# EAGLE design quahog-2-routed (EAGLE 7.6.0)
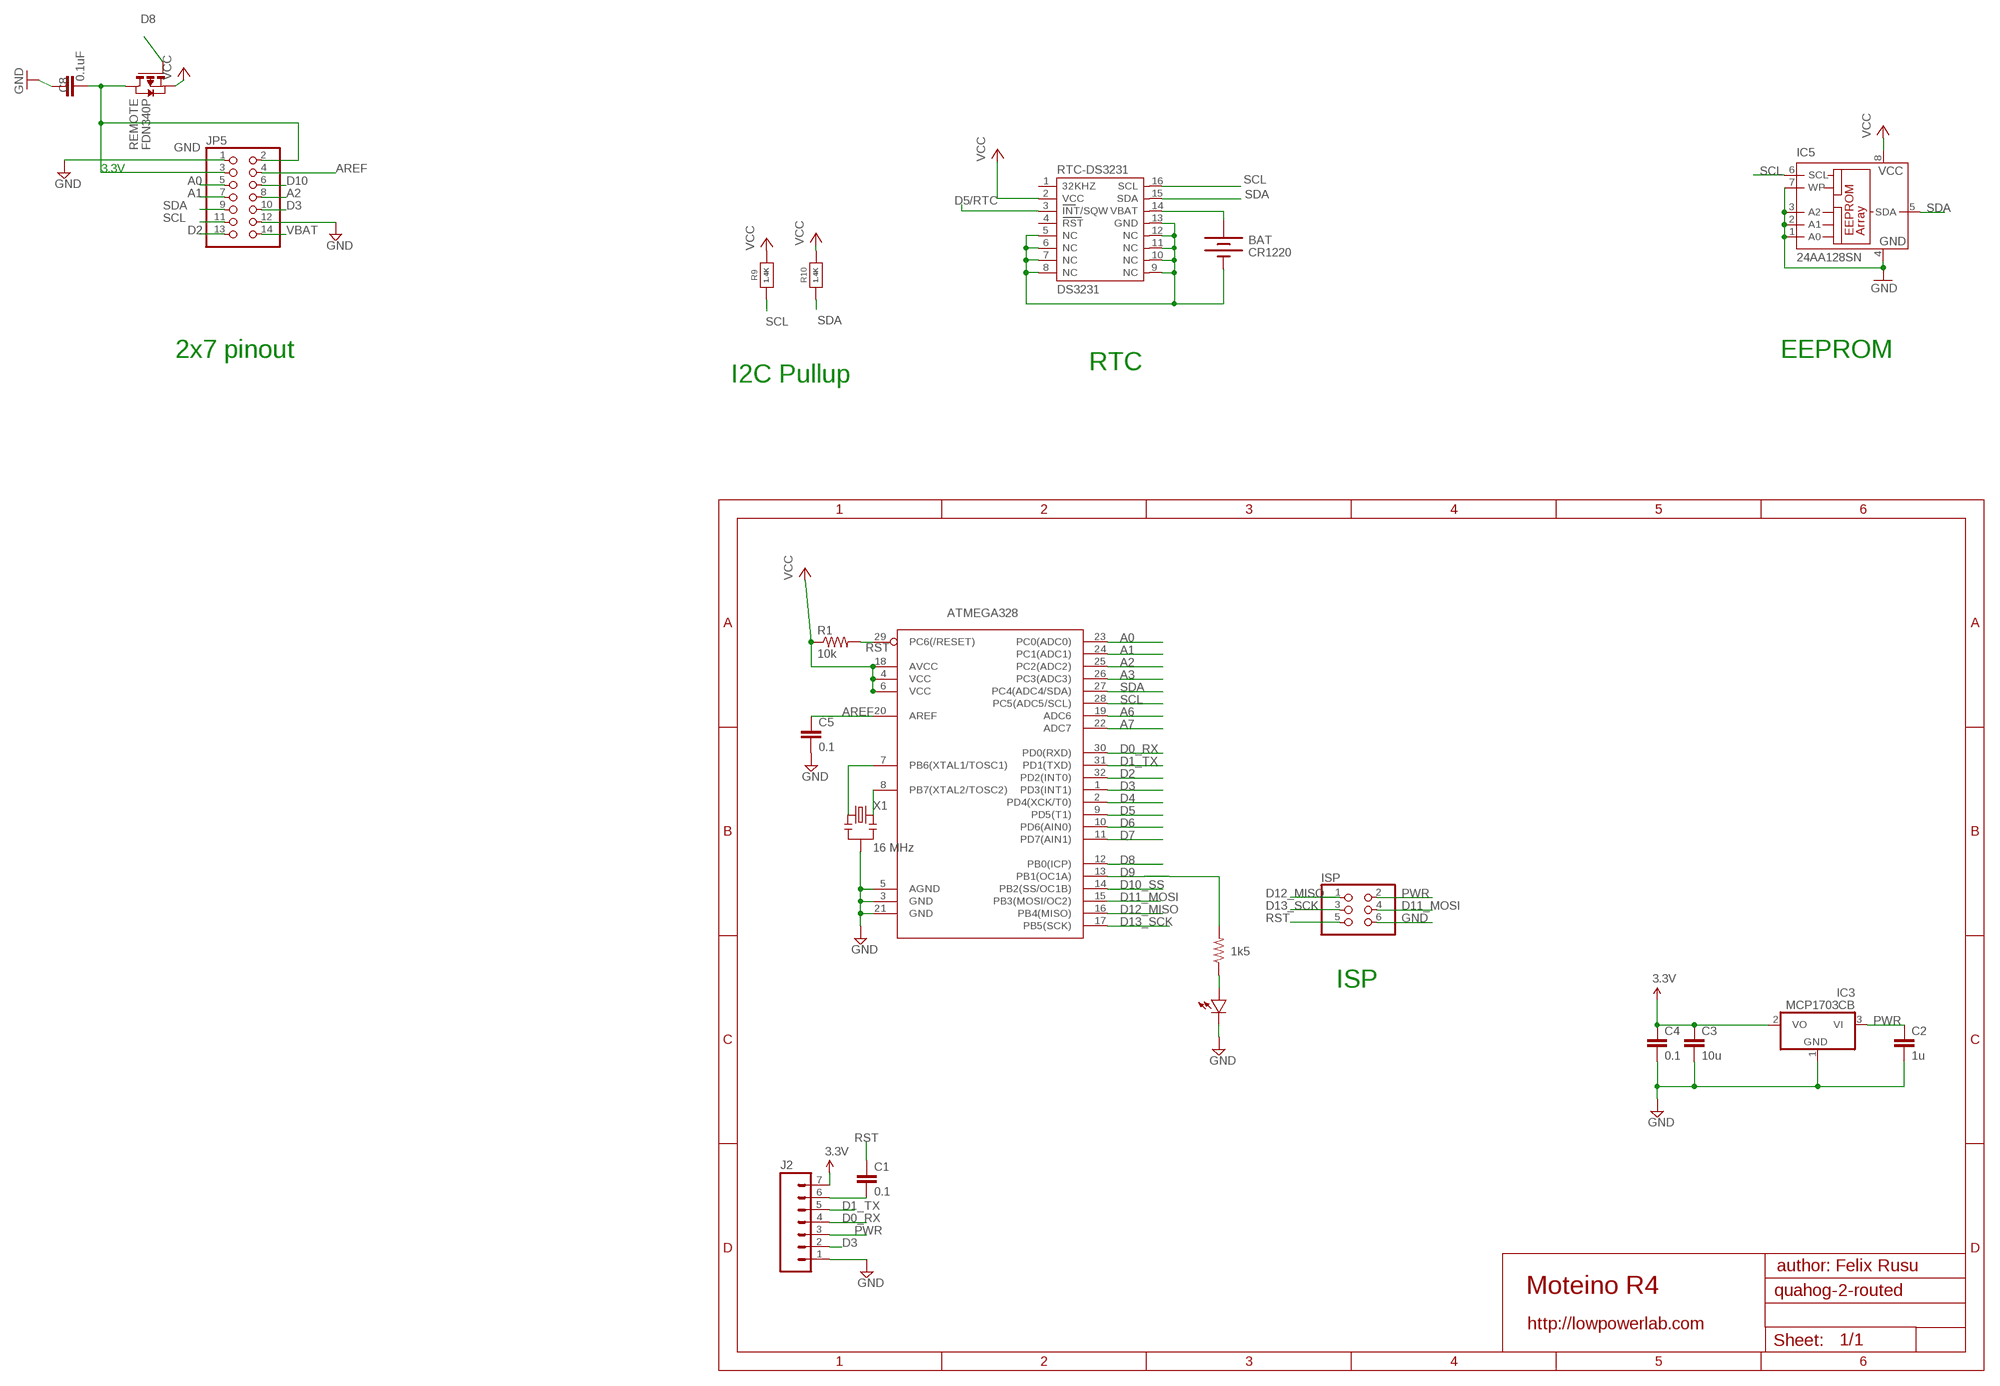
[diagram p0: schematic, sheet 1, part 1 of 2]
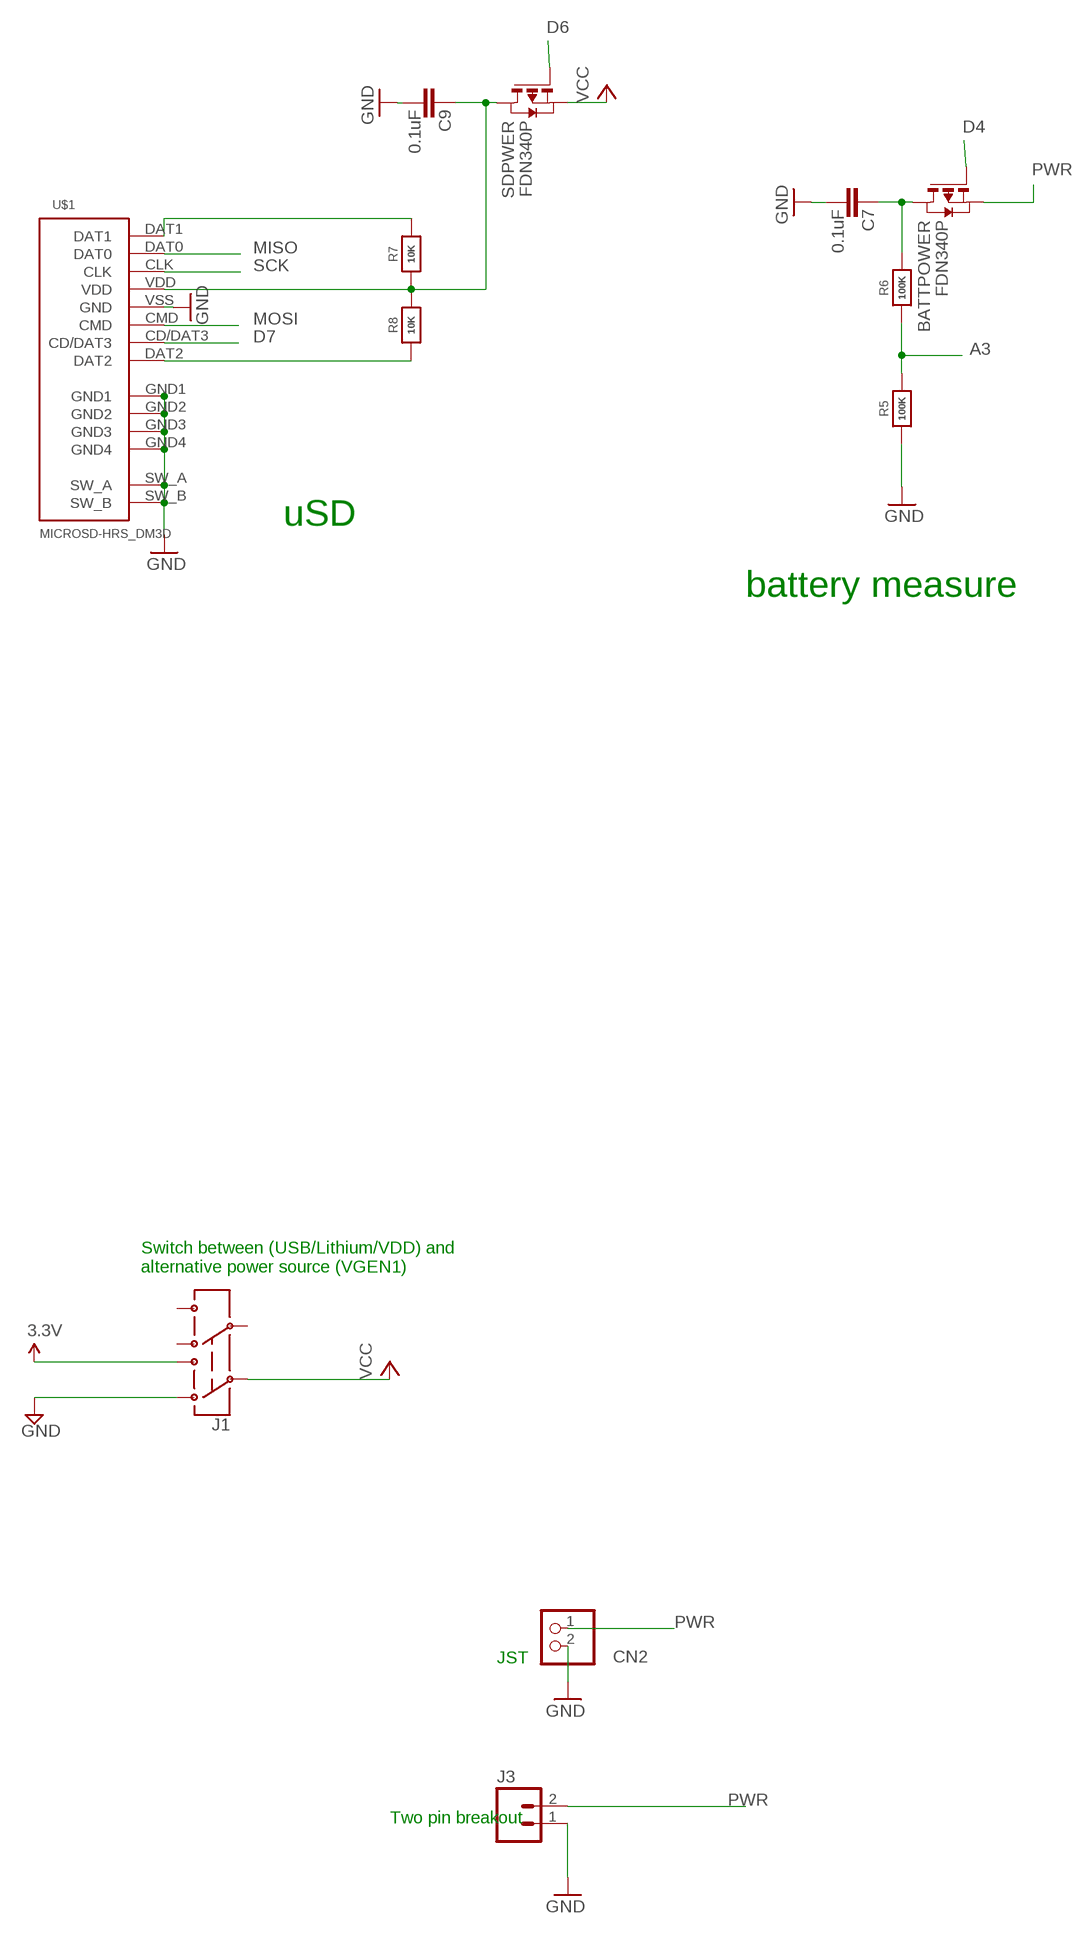
[diagram p1: schematic, sheet 1, part 2 of 2]

## Parts
ATMEGA328  ATMega-328  ATMEGA168/328TQFP32  [TQFP32-08]
BAT  CR1220  BATTERYBATTERY_12MM_SMT  [BATTCON_12MM_SMT]
BATTPOWER  FDN340P  PMOSSOT23  [SOT-23]
C1  0.1  CAP0603-CAP  [0603-CAP]
C2  1u  CAP0603-CAP  [0603-CAP]
C3  10u  CAP0805-CAP  [0805-CAP]
C4  0.1  CAP0603-CAP  [0603-CAP]
C5  0.1  CAP0603-CAP  [0603-CAP]
C7  0.1uF  CAP0603-CAP  [0603-CAP]
C8  0.1uF  CAP0603-CAP  [0603-CAP]
C9  0.1uF  CAP0603-CAP  [0603-CAP]
CN2  JST_2PIN-SMT-RA  [JST-PH-2-SMT-RA]
IC3  MCP1703CB  [SOT23]
IC5  24AA128SN  [SO-08]
ISP  PINHD-2X3  [2X03]
J1  AYZ0202  [AYZ0202]
J2  M07  [1X07]
J3  M02PTH  [1X02]
JP5  PINHD-2X7  [2X07]
R1  10k  RESISTOR0603-RES  [0603-RES]
R2  1k5  RESISTOR0603-RES  [0603-RES]
R5  100K  RESISTOR_0603_NOOUT  [0603-NO]
R6  100K  RESISTOR_0603_NOOUT  [0603-NO]
R7  10K  RESISTOR_0603_NOOUT  [0603-NO]
R8  10K  RESISTOR_0603_NOOUT  [0603-NO]
R9  1.4K  RESISTOR_0603_NOOUT  [0603-NO]
R10  1.4K  RESISTOR_0603_NOOUT  [0603-NO]
REMOTE  FDN340P  PMOSSOT23  [SOT-23]
RTC-DS3231  DS3231  [DS3231]
SDPWER  FDN340P  PMOSSOT23  [SOT-23]
U$1  MICROSD-HRS_DM3D  [DM3D]
U$2  LED0603  [0603-LED]
X1  16 MHz  RESONATORSMD  [RESONATOR-SMD]

## Nets
A0: ATMEGA328.23(PC0(ADC0)) JP5.5
A1: ATMEGA328.24(PC1(ADC1)) JP5.7
A2: ATMEGA328.25(PC2(ADC2)) JP5.8
A3: ATMEGA328.26(PC3(ADC3)) R5.2 R6.1
A6: ATMEGA328.19(ADC6)
A7: ATMEGA328.22(ADC7)
AREF: ATMEGA328.20(AREF) C5.1 JP5.4
D0_RX: ATMEGA328.30(PD0(RXD)) J2.4
D1_TX: ATMEGA328.31(PD1(TXD)) J2.5
D2: ATMEGA328.32(PD2(INT0)) JP5.13
D3: ATMEGA328.1(PD3(INT1)) J2.2 JP5.10
D4: ATMEGA328.2(PD4(XCK/T0)) BATTPOWER.3(G)
D5: ATMEGA328.9(PD5(T1))
D5/RTC: RTC-DS3231.3(INT/SQW)
D6: ATMEGA328.10(PD6(AIN0)) SDPWER.3(G)
D7: ATMEGA328.11(PD7(AIN1)) U$1.CD/DAT3
D8: ATMEGA328.12(PB0(ICP)) REMOTE.3(G)
D9: ATMEGA328.13(PB1(OC1A)) R2.2
D10: JP5.6
D10_SS: ATMEGA328.14(PB2(SS/OC1B))
D11_MOSI: ATMEGA328.15(PB3(MOSI/OC2)) ISP.4
D12_MISO: ATMEGA328.16(PB4(MISO)) ISP.1
D13_SCK: ATMEGA328.17(PB5(SCK)) ISP.3
GND [power]: ATMEGA328.3(GND) ATMEGA328.5(AGND) ATMEGA328.21(GND) BAT.P$1(-) C2.2 C3.2 C4.2 C5.2 C7.1 C8.2 C9.1 CN2.2 IC3.1(GND) IC5.1(A0) IC5.2(A1) IC5.3(A2) IC5.4(GND) IC5.7(WP) ISP.6 J1.3 J2.1 J3.1 JP5.1 JP5.12 R5.1 RTC-DS3231.5(NC) RTC-DS3231.6(NC) RTC-DS3231.7(NC) RTC-DS3231.8(NC) RTC-DS3231.9(NC) RTC-DS3231.10(NC) RTC-DS3231.11(NC) RTC-DS3231.12(NC) RTC-DS3231.13(GND) U$1.GND1 U$1.GND2 U$1.GND3 U$1.GND4 U$1.SW_A U$1.SW_B U$1.VSS(GND) U$2.MINUS X1.2
MISO: U$1.DAT0
MOSI: U$1.CMD
N$1: ATMEGA328.7(PB6(XTAL1/TOSC1)) X1.1
N$2: R2.1 U$2.PLUS
N$4: C9.2 R7.1 R8.2 SDPWER.1(D) U$1.VDD
N$7: C8.1 JP5.2 JP5.3 REMOTE.1(D)
N$15: BATTPOWER.1(D) C7.2 R6.2
N$16: R7.2 U$1.DAT1
N$18: R8.1 U$1.DAT2
N$20: C1.2 J2.6
N$21: ATMEGA328.8(PB7(XTAL2/TOSC2)) X1.3
PWR [power]: BATTPOWER.2(S) C2.1 CN2.1 IC3.3(VI) ISP.2 J2.3 J3.2
RST: ATMEGA328.29(PC6(/RESET)) C1.1 ISP.5 R1.2
RTC_BATT: BAT.P$2(+) RTC-DS3231.14(VBAT)
SCK: U$1.CLK
SCL: ATMEGA328.28(PC5(ADC5/SCL)) IC5.6(SCL) JP5.11 R9.1 RTC-DS3231.16(SCL)
SDA: ATMEGA328.27(PC4(ADC4/SDA)) IC5.5(SDA) JP5.9 R10.1 RTC-DS3231.15(SDA)
VBAT [power]: JP5.14
VCC: ATMEGA328.4(VCC) ATMEGA328.6(VCC) ATMEGA328.18(AVCC) C3.1 C4.1 IC3.2(VO) IC5.8(VCC) J1.1 J1.2 J2.7 R1.1 R9.2 R10.2 REMOTE.2(S) RTC-DS3231.2(VCC) SDPWER.2(S) ; supply symbol labelled 3.3V
Unconnected: J1.4 J1.5 J1.6 RTC-DS3231.1(32KHZ) RTC-DS3231.4(RST)

## Notes on the sheet
- 3.3V
- uSD
- 2x7 pinout | EEPROM
- RTC
- I2C Pullup
- battery measure
- Switch between (USB/Lithium/VDD) and 
  alternative power source (VGEN1)
- ISP
- JST
- Two pin breakout
- author: Felix Rusu
- Moteino R4
- http://lowpowerlab.com

## Library data of the parts
ATMEGA328 = LowPowerLab:ATMEGA168/328: Atmel 32-pin 8-bit micro, 16k flash.
BAT = SparkFunNew:BATTERY: Battery Holders Various common sizes : AA, AAA, 20mm coin cell and 12mm coin cell.
BATTPOWER REMOTE SDPWER = zetex:PMOSSOT23: MOS FET; OC_FARNELL: unknown; OC_NEWARK: unknown
C1-C5 = LowPowerLab:CAP: Capacitor Standard 0603 ceramic capacitor, and 0.1" leaded capacitor.
C7-C9 = SparkFun:CAP: Capacitor Standard 0603 ceramic capacitor, and 0.1" leaded capacitor.
CN2 = adafruit:JST_2PIN: JST 2-Pin Connectors of various flavors SMT-RA (S2B-PH-SM4) 4UConnector #17311 SMT (B2B-PH-SM4) THM-RA (S2B-PH) THM (B2B-PH)
IC3 = linear:MCP1703: 250 mA, 16V, Low Quiescent Current LDO Regulator Source: http://ww1.microchip.com/downloads/en/DeviceDoc/22049b.pdf
IC5 = microchip:24*: Serial EEPROM I2C; MF: MICROCHIP; MPN: 24AA128-I/SN; OC_FARNELL: unknown; OC_NEWARK: 92C6842
ISP = pinhead:PINHD-2X3: PIN HEADER
J1 = SparkFunNew:AYZ0202: SPDT Slide Switch Simple SMD single-pull double-throw slide switch. Good for less than 350mA power switch, switching UARTs between devices, etc. Spark Fun Electronics SKU : COM-00597
J2 = SparkFun-Connectors:M07: Header 7 Standard 7-pin 0.1" header. Use with straight break away headers (SKU : PRT-00116), right angle break away headers (PRT-00553), swiss pins (PRT-00743), machine pins (PRT-00117), and female headers (PRT-00115). NOTES ON THE VARIANTS LOCK and LOCK_LONGPADS... This footprint was designed to help hold the alignment of a through-hole component (i.e. 7-pin header) while soldering it into place. You may notice that each hole has been shifted either up or down by 0.005 of an inch from it's more standard position (which is usually a perfectly straight line). This slight alteration caused the pins (the squares in the middle) to touch the edges of the holes. Because they are alternating, it causes a "brace" to hold the header in place. 0.005 has proven to be the perfect amount of "off-center" position when using our standard breakaway headers. Although looks a little odd when you look at the bare footprint, once you have a header in there, the alteration is very hard to notice. Also, if you push a header all the way into place, it is covered up entirely on the bottom side. This idea of altering the position of holes to aid alignment will be further integrated into the Sparkfun Library for other footprints. It can help hold any component with 3 or more connection pins.
J3 = SparkFun-Connectors:M02: Standard 2-pin 0.1" header. Use with - straight break away headers ( PRT-00116) - right angle break away headers (PRT-00553) - swiss pins (PRT-00743) - machine pins (PRT-00117) - female headers (PRT-00115) Molex polarized connector foot print use with: PRT-08233 with associated crimp pins and housings. 2.54_SCREWTERM for use with PRT-10571. 3.5mm Screw Terminal footprints for PRT-08084 5mm Screw Terminal footprints for use with PRT-08432
JP5 = pinhead:PINHD-2X7: PIN HEADER
R1 R2 = LowPowerLab:RESISTOR: Resistor Basic schematic elements and footprints for 0603, 1206, and PTH resistors.
R5-R10 = microbuilder:RESISTOR: Resistors For new designs, use the packages preceded by an '_' character since they are more reliable: The following footprints should be used on most boards: _0402 - Standard footprint for regular board layouts _0603 - Standard footprint for regular board layouts _0805 - Standard footprint for regular board layouts _1206 - Standard footprint for regular board layouts For extremely tight-pitch boards where space is at a premium, the following 'micro-pitch' footprints can be used (smaller pads, no silkscreen outline, etc.): _0402MP - Micro-pitch footprint for very dense/compact boards _0603MP - Micro-pitch footprint for very dense/compact boards _0805MP - Micro-pitch footprint for very dense/compact boards _1206MP - Micro-pitch footprint for very dense/compact boards
RTC-DS3231 = _lh-library:DS3231
U$1 = hrs_DM3D-SF:MICROSD-HRS_DM3D
U$2 = LowPowerLab:LED
X1 = SparkFun:RESONATOR: Resonator Small SMD resonator. This is the itty bitty 10/20MHz resonators with built in caps. CSTCE10M0G55 and CSTCE20M0V53. Footprint has been reviewed closely but hasn't been tested yet.

## Net classes
1 power: width 0.305 mm

## Board
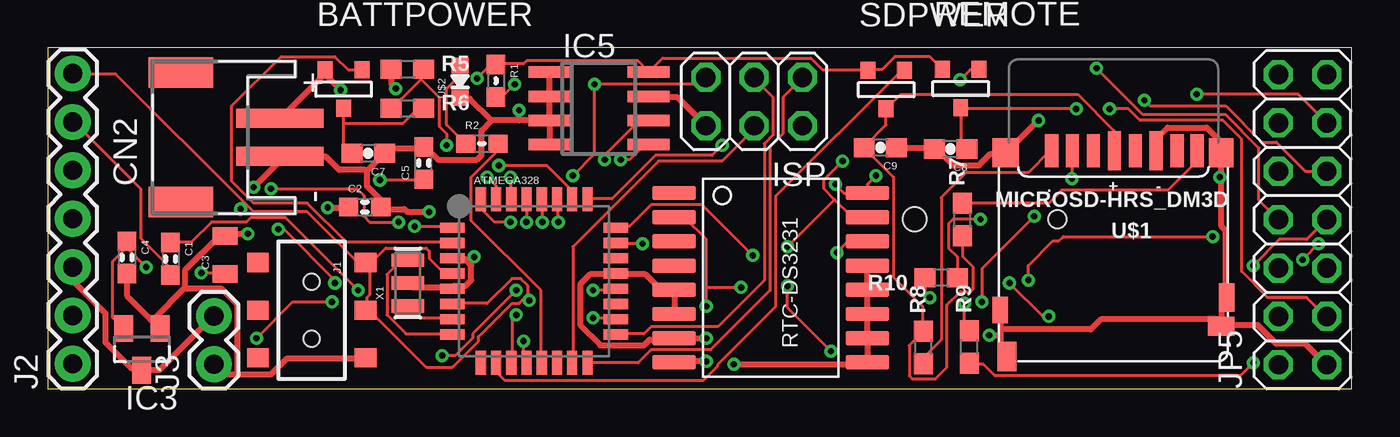
[diagram p2: board, top side]
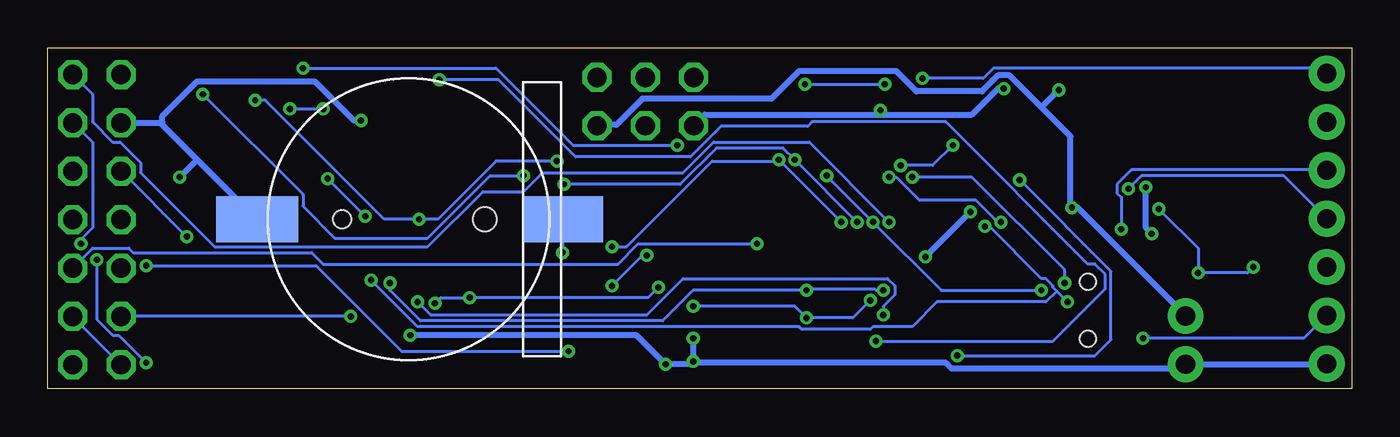
[diagram p3: board, bottom side, seen from below]

Size 68.5 x 17.92 mm. Coordinates in mm from the lower left corner, seen from the top.
Outline: 0,0 68.5,0 68.5,17.92 0,17.92 0,0
Copper layers (1*16): Top 0.0356mm / dielectric 1.5011mm / Bottom 0.0356mm
Design rules "oshpark-2layer": minimum track width 6mil, minimum drill 13mil, track to track 6mil, track to pad 6mil, pad to pad 6mil, via to via 6mil, smd to smd 6mil, copper to edge 15mil, drill to drill 6mil, minimum pad ring 7mil, minimum via ring 7mil, stop-mask expansion 2.5mil, vias tented up to drill 0mil, thermal gap 10mil

### Footprints (pad centres in the part's own frame; a part is rotated, then mirrored left to right if it is on the bottom)
TQFP32-08 = smd 1.27 x 0.533: 1 -4.293,2.8; 2 -4.293,2; 3 -4.293,1.2; 4 -4.293,0.4; 5 -4.293,-0.4; 6 -4.293,-1.2; 7 -4.293,-2; 8 -4.293,-2.8; 17 4.293,-2.8; 18 4.293,-2; 19 4.293,-1.2; 20 4.293,-0.4; 21 4.293,0.4; 22 4.293,1.2; 23 4.293,2; 24 4.293,2.8 | smd 0.533 x 1.27: 9 -2.8,-4.293; 10 -2,-4.293; 11 -1.2,-4.293; 12 -0.4,-4.293; 13 0.4,-4.293; 14 1.2,-4.293; 15 2,-4.293; 16 2.8,-4.293; 25 2.8,4.293; 26 2,4.293; 27 1.2,4.293; 28 0.4,4.293; 29 -0.4,4.293; 30 -1.2,4.293; 31 -2,4.293; 32 -2.8,4.293
BATTCON_12MM_SMT = smd 2.4 x 4.3: P$1 0,11.96 | smd 2.4 x 4.2: P$2 0,-4.1 | hole 0.95: 0,7.5 | hole 1.25: 0,0
SOT-23 = smd 0.787 x 0.889: 1 0.025,-1.016; 2 -0.94,1.016; 3 0.991,1.016
0603-CAP = smd 1.016 x 0.965: 1 -0.85,0; 2 0.85,0
0805-CAP = smd 0.902 x 1.3: 1 -1,0; 2 1,0
0603-CAP' = smd 1.1 x 1: 1 -0.85,0; 2 0.85,0
JST-PH-2-SMT-RA = smd 1 x 4.6: 1 1,-3.7; 2 -1,-3.7 | smd 1.6 x 3.4: NC1 -3.4,1.5; NC2 3.4,1.5
SOT23 = smd 1 x 1.4: 1 -0.95,-1.1; 2 0.95,-1.1; 3 0,1.1
SO-08 = smd 0.6 x 2.2: 1 -1.905,-2.6; 2 -0.635,-2.6; 3 0.635,-2.6; 4 1.905,-2.6; 5 1.905,2.6; 6 0.635,2.6; 7 -0.635,2.6; 8 -1.905,2.6
2X03 = drill 1.016 octagon: 1 -2.54,-1.27; 2 -2.54,1.27; 3 0,-1.27; 4 0,1.27; 5 2.54,-1.27; 6 2.54,1.27
AYZ0202 = smd 1 x 1.15: 1 -2.5,2.825; 2 0,2.825; 3 2.5,2.825; 4 -2.5,-2.825; 5 0,-2.825; 6 2.5,-2.825 | hole 0.85: 1.5,0; -1.5,0
1X07 = drill 1.016 pad 1.88: 1 0,0; 2 2.54,0; 3 5.08,0; 4 7.62,0; 5 10.16,0; 6 12.7,0; 7 15.24,0
1X02 = drill 1.016 pad 1.88: 1 0,0; 2 2.54,0
2X07 = drill 1.016 octagon: 1 -7.62,-1.27; 2 -7.62,1.27; 3 -5.08,-1.27; 4 -5.08,1.27; 5 -2.54,-1.27; 6 -2.54,1.27; 7 0,-1.27; 8 0,1.27; 9 2.54,-1.27; 10 2.54,1.27; 11 5.08,-1.27; 12 5.08,1.27; 13 7.62,-1.27; 14 7.62,1.27
0603-RES = smd 1.016 x 0.965: 1 -0.85,0; 2 0.85,0
0603-NO = smd 1.1 x 1: 1 -0.85,0; 2 0.85,0
DS3231 = smd 0.762 x 2.286: 1 -4.445,-5.08; 2 -3.175,-5.08; 3 -1.905,-5.08; 4 -0.635,-5.08; 5 0.635,-5.08; 6 1.905,-5.08; 7 3.175,-5.08; 8 4.445,-5.08; 9 4.445,5.08; 10 3.175,5.08; 11 1.905,5.08; 12 0.635,5.08; 13 -0.635,5.08; 14 -1.905,5.08; 15 -3.175,5.08; 16 -4.445,5.08
DM3D = smd 0.7 x 1.75: CD/DAT3 8.15,0.45; CLK 4.85,0.45; CMD 7.05,0.45; DAT0 2.65,0.45; DAT1 1.6,0.45; DAT2 9.25,0.45 | smd 0.8 x 1.5: GND1 0.05,8.15 | smd 0.8 x 1.4: GND2 11.95,8.8 | smd 1.4 x 1.5: GND3 11.65,0.55 | smd 1.3 x 1.5: GND4 0.35,0.55 | smd 1 x 1.55: SW_A 11.6,11.25 | smd 1.4 x 1: SW_B 0.35,9.65 | smd 0.7 x 2.032: VDD 5.95,0.45; VSS 3.75,0.45
0603-LED = smd 0.8 x 0.9: MINUS -0.85,0; PLUS 0.85,0
RESONATOR-SMD = smd 0.7 x 1.7: 1 -1.2,0; 2 0,0; 3 1.2,0

### Placement (x,y rotation side)
ATMEGA328  25.55,5.66 0 top
BAT  45.54,8.92 90 bottom
BATTPOWER  15.52,15.75 0 top
C1  6.45,6.83 270 top
C2  16.66,9.55 0 top
C3  9.32,7.04 90 top
C4  4.17,6.91 270 top
C5  19.76,11.86 90 top
C7  0.1uF  [0603-CAP']  16.84,12.37 180 top
C8  0.1uF  [0603-CAP']  47.42,12.6 180 top
C9  0.1uF  [0603-CAP']  43.74,12.67 180 top
CN2  8.51,13.21 90 top
IC3  4.95,2.08 180 top
IC5  28.96,14.73 270 top
ISP  37.11,15.09 180 top
J1  13.87,4.14 270 top
J2  1.32,1.32 90 top
J3  8.74,1.3 90 top
JP5  65.91,8.89 90 top
R1  23.55,16.18 270 top
R2  22.81,12.88 0 top
R5  18.9,16.79 0 top
R6  18.9,14.73 0 top
R7  48.06,8.89 90 top
R8  46,2.18 90 top
R9  48.41,2.21 90 top
R10  46.94,5.84 180 top
REMOTE  47.93,15.77 0 top
RTC-DS3231  37.97,5.84 270 top
SDPWER  44.02,15.72 0 top
U$1  61.98,12.95 180 top
U$2  21.67,16.13 90 top
X1  18.92,5.56 90 top

### Tracks (layer width: path | path; a pad name or v marks a point on that pad's centre or on a via)
A0  (via drill 0.33)
  Top 0.152: v31.24,7.62 29.87,7.62 ATMEGA328.23
  Bottom 0.152: v31.24,7.62 37.49,7.62 38.56,6.55 54.03,6.55 54.64,7.16 64.01,7.16 64.24,7.39 66.14,7.39 JP5.5
A1  (via drill 0.33)
  Top 0.152: v37.03,7.01 34.37,9.68 31.7,9.68 30.56,8.53 29.87,8.53 ATMEGA328.24 | v38.86,5.41 38.86,4.27 v41.15,1.98 | v63.32,6.48 64.69,7.85 66.14,7.85 JP5.7
  Bottom 0.152: v37.03,7.01 37.26,7.01 v38.86,5.41 | v41.15,1.98 49.91,1.98 54.41,6.48 v63.32,6.48
A2  (via drill 0.33)
  Top 0.152: v35.43,12.8 34.9,12.27 31.93,12.27 29.64,9.98 28.42,9.98 ATMEGA328.25 | v55.09,16.84 57.53,14.4 61.87,14.4 63.63,12.65 63.63,9.91 JP5.8
  Bottom 0.152: v35.43,12.8 40.92,12.8 44.96,16.84 v55.09,16.84
A3  (via drill 0.33)
  Top 0.152: 19.62,16.27 19.74,16.38 19.74,16.76 R5.2 | 19.62,16.27 18.52,15.16 18.44,15.16 18.06,14.78 R6.1 | v23.7,11.73 26.21,11.73 27.51,10.44 27.51,9.98 ATMEGA328.26 | v20.95,12.8 20.95,13.41 20.57,13.79 20.57,15.32 19.62,16.27
  Bottom 0.152: v23.7,11.73 22.02,11.73 v20.95,12.8
AREF  (via drill 0.33)
  Top 0.152: v17.45,10.97 19.74,10.97 C5.1 | v20.73,1.75 21.41,1.75 22.33,2.67 22.33,2.9 v24.61,5.18 | v28.65,5.18 29.72,5.18 29.79,5.26 ATMEGA328.20 | v52.58,3.81 52.27,3.81 v50.52,5.56
  Bottom 0.152: v17.45,10.97 12.65,6.17 12.65,2.59 13.49,1.75 v20.73,1.75 | v24.61,5.18 24.99,5.18 25.07,5.26 28.57,5.26 v28.65,5.18 34.6,5.18 36.2,3.58 48.92,3.58 50.52,5.18 v50.52,5.56 | v52.58,3.81 JP5.4
D0_RX  (via drill 0.33)
  Top 0.152: v24.31,11.12 24.31,9.98 ATMEGA328.30 | v18.44,8.76 16.92,8.76 16.61,9.07 16.61,10.13 16.23,10.52 v11.73,10.52
  Bottom 0.152: v24.31,11.12 23.93,11.12 22.71,9.91 19.74,9.91 18.59,8.76 v18.44,8.76 | v11.73,10.52 11.05,11.2 3.58,11.2 J2.4
D1_TX  (via drill 0.33)
  Top 0.152: v23.09,11.12 23.55,10.67 23.55,9.98 ATMEGA328.31 | v15.09,5.56 15.09,5.71 12.42,8.38 v12.12,8.38
  Bottom 0.152: v23.09,11.12 19.96,11.12 15.09,6.25 v15.09,5.56 | v12.12,8.38 12.12,10.06 12.34,10.29 12.34,10.74 11.58,11.51 1.37,11.51 J2.5
D2  (via drill 0.33)
  Top 0.152: v24.31,8.76 23.47,8.76 22.78,9.45 22.78,9.91 ATMEGA328.32
  Bottom 0.152: v24.31,8.76 28.5,12.95 33.53,12.95 35.13,11.35 42.52,11.35 43.51,10.36 45.64,10.36 48.54,7.47 59.74,7.47 63.63,11.35 63.63,11.89 64.69,12.95 65.07,12.95 66.14,14.02 66.14,15.47 JP5.13
D3  (via drill 0.33)
  Top 0.152: v19.28,8.53 21.26,8.53 ATMEGA328.1 | v14.93,4.57 12.88,4.57 v10.97,2.67 | v61.19,8 53.34,8 53.11,7.77 52.81,7.77 51.51,6.48 v51.51,5.71
  Bottom 0.152: v19.28,8.53 19.05,8.53 16.31,5.79 16.08,5.79 15.7,5.41 15.7,5.33 15.51,5.14 | v14.93,4.57 15.51,5.14 | v10.97,2.67 2.51,2.67 J2.2 | v61.19,8 64.62,11.43 JP5.10 | v51.51,5.71 49.07,3.28 29.03,3.28 28.88,3.12 25.3,3.12 25.15,3.28 23.09,3.28 21.79,4.57 16.08,4.57 15.51,5.14
D4
  Top 0.152: BATTPOWER.3 15.77,16.76 15.09,17.45 12.27,17.45 9.68,14.86 9.68,10.9 10.82,9.75 13.64,9.75 15.7,7.7 21.26,7.7 ATMEGA328.2
D6
  Top 0.152: SDPWER.3 44.96,16.69 44.81,16.69 38.25,10.13 38.25,4.34 35.2,1.29 35.2,1.22 34.44,0.46 24,0.46 23.62,0.84 23.62,1.37 ATMEGA328.10
D7  (via drill 0.33)
  Top 0.152: v24.61,3.89 24.38,3.66 24.38,1.37 ATMEGA328.11 | v49.07,4.57 49.07,6.33 v51.82,9.07 | v53.8,11.05 53.8,12.5 U$1.CD/DAT3
  Bottom 0.152: v24.61,3.89 24.61,4.34 24,4.95 24,5.41 24.38,5.79 35.13,5.79 37.03,3.89 48.39,3.89 v49.07,4.57 | v53.8,11.05 v51.82,9.07
D8  (via drill 0.33)
  Top 0.152: v47.93,16.23 48.46,16.76 48.92,16.76 REMOTE.3 | v24.99,2.52 24.99,1.52 ATMEGA328.12
  Bottom 0.152: v47.93,16.23 44.81,16.23 40.77,12.19 34.75,12.19 33.15,13.79 28.57,13.79 28.35,14.02 21.34,14.02 13.87,6.55 13.49,6.55 12.95,6.02 12.95,5.26 15.7,2.52 v24.99,2.52
D9
  Top 0.152: R2.2 23.62,12.88 23.62,12.5 22.25,11.12 22.25,8.84 25.91,5.18 25.91,1.37 ATMEGA328.13
D11_MOSI
  Top 0.152: ISP.4 37.11,13.64 35.43,11.96 32.08,11.96 27.58,7.47 27.58,1.37 ATMEGA328.15
D12_MISO
  Top 0.152: ATMEGA328.16 31.01,1.37 31.7,2.06 34.82,2.06 37.95,5.18 37.95,12.72 38.63,13.41 38.63,15.32 39.62,16.31 ISP.1
D13_SCK
  Top 0.152: ATMEGA328.17 29.87,2.9 31.32,2.9 31.7,3.28 35.2,3.28 37.64,5.71 37.64,12.88 38.1,13.34 38.1,15.32 37.11,16.31 ISP.3
GND  (via drill 0.33)
  Top 0.305: C9.1 44.65,12.65 46.56,12.65 C8.2 46.71,12.57 47.55,11.73 48.92,11.73 49.53,12.34 50.29,12.34 U$1.GND3 50.44,12.5 v52.05,14.1 | U$1.VSS 58.29,12.57 58.29,13.18 58.83,13.72 60.88,13.72 61.57,13.03 61.57,12.42 U$1.GND4 61.65,12.27 61.65,11.12 | 50.06,2.82 50.06,2.06 50.37,1.75 U$1.SW_A | 50.06,2.82 50.06,3.12 | 50.06,3.12 50.06,4.12 U$1.GND2 | U$1.SW_B 61.65,3.35 61.65,4.57 61.87,4.8 U$1.GND1 61.87,4.95 61.87,8.31 61.65,8.53 61.65,11.12 | U$1.SW_B 61.8,3.35 63.55,3.35 64.54,2.36 66.06,2.36 67.13,1.29 JP5.1 | 50.06,3.12 54.79,3.12 55.32,3.66 61.57,3.66 U$1.SW_B | v61.57,11.12 61.65,11.12 | v18.29,15.77 18.06,16 18.06,16.76 R5.1 | ISP.6 33.07,15.32 31.62,15.32 IC5.7 | 23.32,14.1 22.17,15.24 21.72,15.24 U$2.MINUS | IC5.3 24.76,14.1 | 24.76,14.1 23.32,14.1 | IC5.4 26.36,12.88 26.36,14.02 IC5.3 | IC5.3 26.36,14.25 26.36,15.32 IC5.2 26.36,15.47 26.36,16.61 IC5.1 | X1.2 18.97,5.56 19.2,5.33 21.26,5.33 ATMEGA328.5 21.34,5.41 21.95,5.41 22.25,5.71 22.25,6.48 22.1,6.63 | 22.1,6.63 21.87,6.86 ATMEGA328.3 | 16.76,11.43 16.76,10.67 17.45,9.98 17.45,9.6 C2.2 17.6,9.45 18.74,9.45 18.9,9.3 v20.04,9.3 | 16.76,11.43 17.68,12.34 C7.1 17.83,12.42 18.06,12.65 19.74,12.65 C5.2 19.89,12.65 20.5,12.04 22.55,12.04 22.78,12.27 22.78,13.56 23.32,14.1 | v22.4,6.93 22.1,6.63 | 16.76,11.43 16.69,11.51 15.32,11.51 14.63,12.19 12.27,12.19 CN2.2 12.27,12.04 v10.82,10.59 | 24.76,14.1 v24.76,14.63 | RTC-DS3231.13 RTC-DS3231.12 RTC-DS3231.11 RTC-DS3231.10 RTC-DS3231.9 42.98,1.29 v36.04,1.29 | v34.6,1.45 32.92,1.45 RTC-DS3231.8 | v34.6,2.67 RTC-DS3231.7 32.77,2.59 31.62,2.59 31.32,2.29 29.03,2.29 27.96,3.35 27.96,5.49 28.5,6.02 29.72,6.02 ATMEGA328.21 29.87,6.02 31.39,6.02 32.16,5.26 32.84,5.26 RTC-DS3231.5 32.92,5.11 32.92,3.96 RTC-DS3231.6
  Top 0.305: C4.2 4.19,6.02 4.19,4.88 5.87,3.2 IC3.1 5.56,3.66 7.24,5.33 | 7.24,5.33 7.24,6.25 8.99,8 9.3,8 C3.2 9.37,8.15 v10.52,8.15 | 9.98,0.76 9.3,0.76 8.76,1.29 J3.1 | 9.98,0.76 11.73,0.76 12.57,1.6 16.69,1.6 J1.3 | 9.98,0.76 9.98,4.42 9.14,5.26 7.32,5.26 7.24,5.33 | v49.45,2.82 50.06,2.82
  Bottom 0.305: 62.56,13.95 64.62,13.95 JP5.12 | 60.66,12.04 57.53,8.91 BAT.P$1 | 60.66,12.04 62.56,13.95 | v52.05,14.1 52.43,14.1 54.48,16.15 60.66,16.15 62.48,14.33 62.48,14.02 62.56,13.95 | v61.57,11.12 60.66,12.04 | v18.29,15.77 18.59,15.77 19.96,14.4 24.76,14.4 | 24.76,14.4 33.98,14.4 ISP.6 | v20.04,9.3 v22.4,6.93 | v24.76,14.63 24.76,14.4 | v34.6,2.67 v34.6,1.45 | v34.6,1.45 34.75,1.29 v36.04,1.29 37.57,2.82 v49.45,2.82 | J2.1 1.37,1.29 J3.1 8.84,1.22 8.99,1.07 21.03,1.07 21.34,1.37 34.52,1.37 v34.6,1.45 | v10.82,10.59 10.82,8.46 v10.52,8.15
N$1
  Top 0.152: ATMEGA328.7 21.26,3.73 19.58,3.73 18.97,4.34 X1.1
N$2
  Top 0.152: U$2.PLUS 21.64,16.92 21.64,16.46 20.95,15.77 20.95,13.87 21.95,12.88 R2.1
N$4
  Top 0.152: R7.1 48.08,8 48.08,6.93 48.62,6.4 48.62,5.26 48.46,5.11 47.93,5.11 47.24,4.42 47.24,1.14 46.63,0.53 45.41,0.53 45.26,0.69 45.26,2.29 45.95,2.97 R8.2 45.95,3.05 45.95,4.34 44.43,5.87 44.43,11.12 42.9,12.65 C9.2 42.9,12.72 44.04,13.87 SDPWER.1 44.81,15.47 54.1,15.47 56.01,13.56 56.01,12.57 U$1.VDD
N$7  (via drill 0.33)
  Top 0.152: 48.01,14.71 48.01,12.88 48.23,12.65 C8.1 | v54.03,14.71 48.01,14.71 | v55.78,14.71 56.77,14.71 57.38,14.1 61.72,14.1 62.71,13.11 62.71,6.17 64.08,4.8 66.14,4.8 67.13,3.81 JP5.3 | 48.01,14.71 REMOTE.1
  Bottom 0.152: v55.78,14.71 v54.03,14.71 | JP5.2 64.69,1.29 67.21,3.81 JP5.3
N$15
  Top 0.152: 15.54,13.95 15.54,12.8 15.93,12.42 C7.2 | 15.54,13.95 BATTPOWER.1 | 15.54,13.95 18.67,13.95 19.43,14.71 19.74,14.71 R6.2
N$16
  Top 0.152: R7.2 48.08,9.75 52.58,9.75 53.26,10.44 58.83,10.44 60.35,11.96 60.35,12.5 U$1.DAT1
N$18
  Top 0.152: R8.1 46.03,1.37 46.03,1.68 46.94,2.59 46.94,10.06 48.23,11.35 51.51,11.35 52.65,12.5 U$1.DAT2
N$20
  Top 0.152: C1.2 6.4,6.02 6.4,6.4 4.88,7.92 4.88,10.52 1.37,14.02 J2.6
N$21
  Top 0.152: ATMEGA328.8 21.26,2.9 18.82,2.9 17.83,3.89 17.83,6.02 18.52,6.71 18.9,6.71 X1.3
PWR  (via drill 0.33)
  Top 0.305: CN2.1 12.27,14.25 14.55,16.54 14.55,16.76 BATTPOWER.2 14.63,16.46 v15.39,15.7 | v14.71,9.53 15.77,9.53 C2.1 | J3.2 8.69,3.81 5.87,0.99 IC3.3 4.88,1.07 4.42,1.07 3.05,2.44 3.05,3.96 1.37,5.64 1.37,6.4 J2.3
  Bottom 0.305: J3.2 8.76,3.89 14.4,9.53 v14.71,9.53 14.78,9.6 14.78,13.26 16.31,14.78 | 16.31,14.78 17.98,16.46 18.59,16.46 19.43,15.62 22.86,15.62 23.93,16.69 29.03,16.69 30.48,15.24 37.26,15.24 38.63,13.87 39.62,13.87 ISP.2 | 16.31,14.78 v15.39,15.7
RST  (via drill 0.33)
  Top 0.152: v24.54,16 23.93,15.39 23.55,15.39 R1.2 | ISP.5 34.21,16 v28.73,16 28.73,12.34 v27.58,11.2 | v16.31,5.18 12.5,8.99 10.67,8.99 10.44,8.76 8.61,8.76 7.54,7.7 6.48,7.7 C1.1 | v25.15,8.76 25.15,9.91 ATMEGA328.29
  Bottom 0.152: v28.73,16 v24.54,16 | v16.31,5.18 21.56,5.18 v25.15,8.76 v27.58,11.2
RTC_BATT  (via drill 0.33)
  Top 0.152: v41.45,7.16 41.99,7.7 43.05,7.7 RTC-DS3231.14
  Bottom 0.152: v41.45,7.16 41.45,8.91 BAT.P$2
SCL  (via drill 0.33)
  Top 0.152: v25.98,8.76 25.98,9.91 ATMEGA328.28 | v29.26,12.04 29.26,12.27 31.09,14.1 IC5.6 | v41.38,10.74 41.83,10.29 RTC-DS3231.16 43.05,10.74 v43.51,11.2 | v63.32,1.37 62.64,0.69 49.76,0.69 49.15,1.29 48.46,1.29 R9.1 | v66.75,7.62 v65.91,6.78 | v60.35,15.47 65.68,15.47 JP5.11
  Bottom 0.152: v25.98,8.76 v29.26,12.04 29.87,12.65 33.38,12.65 35.28,10.74 v41.38,10.74 | v63.32,1.37 64.77,2.82 65.07,2.82 65.91,3.66 v65.91,6.78 | v66.75,7.62 66.75,7.85 66.14,8.46 66.14,12.95 67.13,13.95 JP5.11 | v43.51,11.2 45.26,11.2 48.54,7.92 53.42,7.92 55.09,9.6 55.09,10.21 v60.35,15.47
SDA  (via drill 0.33)
  Top 0.152: v26.82,8.76 26.82,9.91 ATMEGA328.27 | v30.1,12.04 30.56,12.04 31.32,12.8 31.55,12.8 IC5.5 | v49,8.91 47.55,8.91 47.32,8.69 47.32,7.39 47.78,6.93 47.78,5.87 R10.1 | v41.76,11.96 40.77,10.97 40.77,10.52 41.34,9.94 | 41.34,9.94 42.22,9.07 43.05,9.07 RTC-DS3231.15 | JP5.9 66.06,11.43 64.54,12.95 63.78,12.95 61.87,14.86 57.91,14.86 v57.61,15.16 | 41.34,9.94 v38.86,7.47
  Bottom 0.152: v26.82,8.76 v30.1,12.04 30.1,11.96 33.6,11.96 38.1,7.47 v38.86,7.47 | v41.76,11.96 44.96,11.96 48.01,8.91 v49,8.91 50.83,8.91 57.07,15.16 v57.61,15.16
VCC  (via drill 0.33)
  Top 0.152: REMOTE.2 46.33,17.45 44.5,17.45 43.82,16.76 43.13,16.76 SDPWER.2 43.05,16.76 40.69,16.76 40.08,17.37 32.31,17.37 31.62,16.69 IC5.8 31.55,16.69 31.01,17.22 25.15,17.22 24.99,17.07 23.55,17.07 R1.1 23.55,16.99 23.24,16.99 v22.55,16.31 | 4.11,7.47 4.11,7.39 3.43,6.71 3.43,3.73 3.96,3.2 IC3.2 | 4.11,7.47 4.11,7.7 C4.1 4.11,7.47 | v8.08,6.1 9.3,6.1 C3.1 | 4.11,7.47 v5.18,6.4 | v46.33,4.8 46.1,5.03 46.1,5.79 R10.2 | v48.16,4.5 48.16,3.35 48.39,3.12 R9.2 | J1.1 16.76,6.63 16.92,6.48 16.92,4.95 16.76,4.8 16.76,4.19 J1.2 16.84,4.19 19.89,1.14 21.26,1.14 22.63,2.52 22.63,2.74 24.38,4.5 24.76,4.5 25.11,4.84 | 25.11,4.84 25.22,4.95 25.22,5.41 24.84,5.79 24.38,5.79 23.09,4.5 21.26,4.5 ATMEGA328.6 | ATMEGA328.4 21.26,6.1 20.8,6.1 20.04,6.86 20.04,7.24 19.89,7.39 17.75,7.39 16.92,6.55 J1.1 | v28.65,3.73 29.79,3.73 ATMEGA328.18 | 25.11,4.84 v25.3,4.65 | v34.6,4.34 34.6,5.33 | 34.6,5.33 34.6,7.85 33.45,8.99 32.92,8.99 RTC-DS3231.2 | 34.6,5.33 v36.42,5.33 | 10.4,9.72 10.82,9.3 13.64,9.3 16.23,6.71 16.69,6.71 J1.1 | 10.4,9.72 3.58,16.54 1.37,16.54 J2.7 | 10.4,9.72 v10.13,9.45
  Bottom 0.152: v5.18,6.4 5.49,6.1 v8.08,6.1 8.08,7.39 v10.13,9.45 | v48.16,4.5 47.85,4.8 v46.33,4.8 36.96,4.8 v36.42,5.33 | v25.3,4.65 26.21,3.73 v28.65,3.73 29.26,4.34 v34.6,4.34 | v22.55,16.31 19.36,16.31 18.82,16.84 1.6,16.84 J2.7